# EAGLE design geiger-counter-usb (EAGLE 5.11)
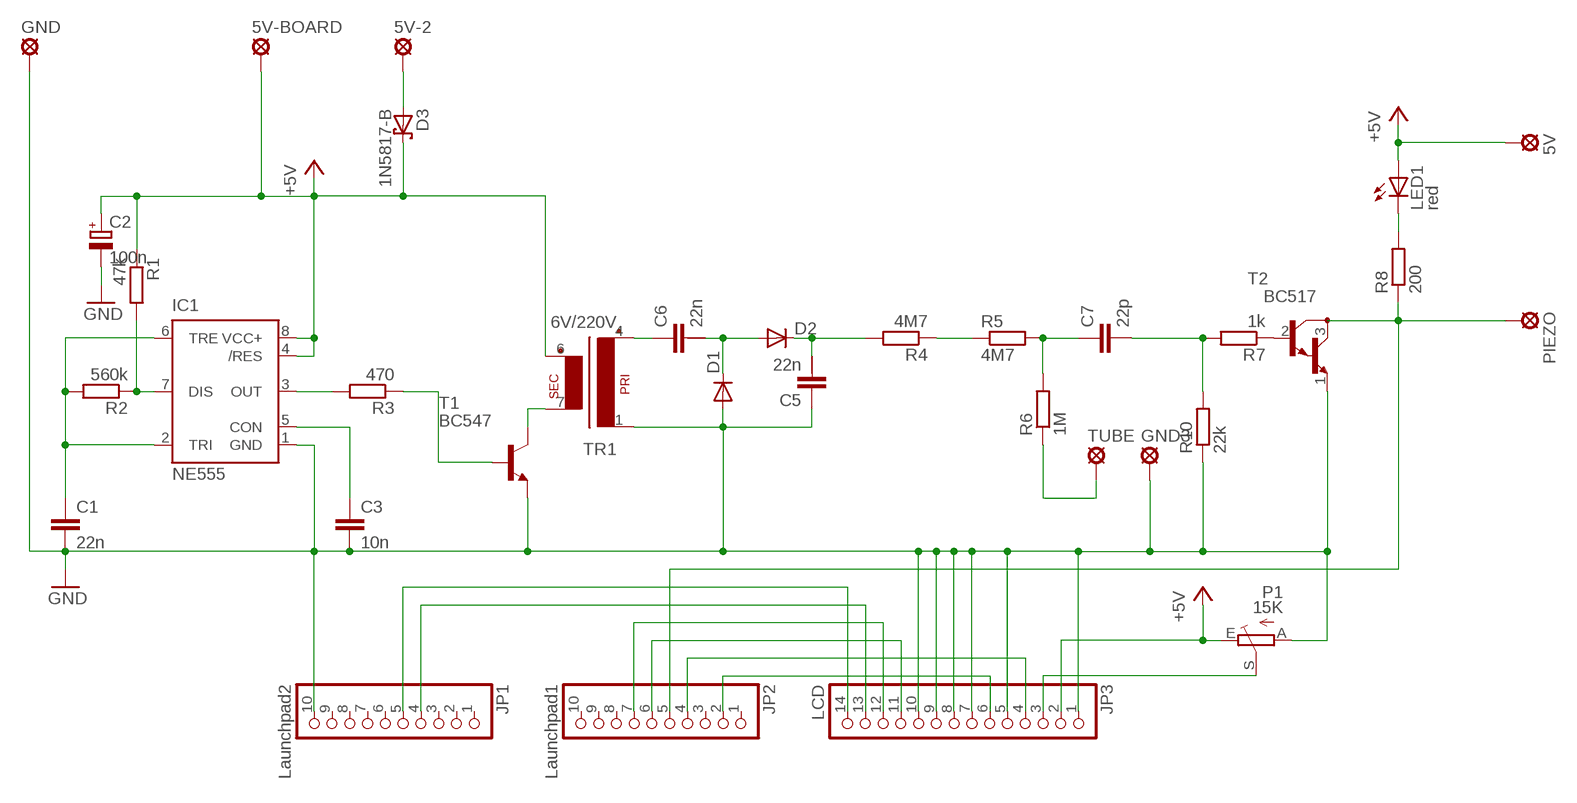
[diagram p0: schematic, sheet 1]

## Parts
5V  MCS08  [MCS08]
5V-2  MCS08  [MCS08]
5V-BOARD  MCS08  [MCS08]
C1  22n  C5/3.5  [C5B3.5]
C2  100n  CPOL-EUB45181B  [B45181B]
C3  10n  C5/3.5  [C5B3.5]
C5  22n  C-10-15/6  [C10-15B6]
C6  22n  C-10-15/6  [C10-15B6]
C7  22p  C15/5  [C15B5]
D1  1N4004  [DO41-10]
D2  1N4004  [DO41-10]
D3  1N5817-B  SCHOTTKY-DIODEDO35-7  [DO35-7]
GND  MCS08  [MCS08]
GND3  MCS08  [MCS08]
IC1  NE555  [DIL-08]
JP1  Launchpad2  PINHD-1X10  [1X10]
JP2  Launchpad1  PINHD-1X10  [1X10]
JP3  LCD  PINHD-1X14  [1X14]
LED1  red  LED3MM  [LED3MM]
P1  15K  TRIM_EU-PT10S  [PT-10S]
PIEZO  MCS08  [MCS08]
R1  47k  R-EU_0207/2V  [0207/2V]
R2  560k  R-EU_0207/2V  [0207/2V]
R3  470  R-EU_0207/2V  [0207/2V]
R4  4M7  R-EU_0207/2V  [0207/2V]
R5  4M7  R-EU_0207/7  [0207/7]
R6  1M  R-EU_0207/2V  [0207/2V]
R7  1k  R-EU_0204/2V  [0204V]
R8  200  R-EU_0207/2V  [0207/2V]
R10  22k  R-EU_0207/2V  [0207/2V]
T1  BC547  [TO92]
T2  BC517  [TO92]
TR1  6V/220V  EE20-1  [EE20-1]
TUBE  MCS08  [MCS08]

## Nets
+5V: 5V-BOARD.MP 5V.MP C2.+ D3.C IC1.4(/RES) IC1.8(VCC+) JP3.2 LED1.A P1.E R1.1 TR1.6(S3)
GND: C1.2 C2.- C3.2 C5.1 D1.A GND3.MP GND.MP IC1.1(GND) JP1.10 JP3.1 JP3.5 JP3.7 JP3.8 JP3.9 JP3.10 P1.A R10.1 T1.1(E) T2.1(E) TR1.1
N$1: R3.1 T1.2(B)
N$2: C1.1 IC1.2(TRI) IC1.6(TRE) R2.2
N$3: IC1.7(DIS) R1.2 R2.1
N$4: LED1.K(C) R8.2
N$5: C3.1 IC1.5(CON)
N$6: R4.1 R5.1
N$7: C7.1 R5.2 R6.2
N$8: C6.1 TR1.4(P2)
N$9: C5.2 D2.C R4.2
N$10: C6.2 D1.C D2.A
N$11: C7.2 R7.2 R10.2
N$12: R6.1 TUBE.MP
N$13: IC1.3(OUT) R3.2
N$14: R7.1 T2.2(B)
N$15: T1.3(C) TR1.7(S4)
N$16: 5V-2.MP D3.A
N$18: JP2.5 PIEZO.MP R8.1 T2.3(C)
N$20: JP1.4 JP3.13
N$22: JP3.3 P1.S
N$23: JP2.2 JP3.6
N$24: JP2.4 JP3.4
N$25: JP2.6 JP3.11
N$26: JP2.7 JP3.12
N$27: JP1.5 JP3.14
Unconnected: C5.3 C6.3 JP1.1 JP1.2 JP1.3 JP1.6 JP1.7 JP1.8 JP1.9 JP2.1 JP2.3 JP2.8 JP2.9 JP2.10

## Library data of the parts
5V 5V-2 5V-BOARD GND GND3 PIEZO TUBE = solpad:MCS08: SOLDER PAD MC S0,8, drill 1.2 mm, distributor Buerklin, 08F130
C1 C3 C7 = capacitor-wima:C: CAPACITOR naming: grid - package width
C2 = rcl:CPOL-EU: POLARIZED CAPACITOR, European symbol
C5 C6 = capacitor-wima:C-: CAPACITOR for alternative placement naming: default grid - extended grid/package width
D1 D2 = diode:1N4004: DIODE general purpose rectifier, 1 A
D3 = diode:SCHOTTKY-DIODE: Schottky Diode
IC1 = st-microelectronics:NE555: General purpose bipolar Timer; MF: Arrow Electronics; MPN: NE555N; OC_FARNELL: 1467742; OC_NEWARK: 89K1486
JP1 JP2 = pinhead:PINHD-1X10: PIN HEADER
JP3 = pinhead:PINHD-1X14: PIN HEADER
LED1 = led:LED: LED OSRAM: - CHIPLED LG R971, LG N971, LY N971, LG Q971, LY Q971, LO R971, LY R971 LH N974, LH R974 LS Q976, LO Q976, LY Q976 LO Q996 - Hyper CHIPLED LW Q18S LB Q993, LB Q99A, LB R99A - SideLED LS A670, LO A670, LY A670, LG A670, LP A670 LB A673, LV A673, LT A673, LW A673 LH A674 LY A675 LS A676, LA A676, LO A676, LY A676, LW A676 LS A679, LY A679, LG A679 - Hyper Micro SIDELED® LS Y876, LA Y876, LO Y876, LY Y876 LT Y87S - SmartLED LW L88C, LW L88S LB L89C, LB L89S, LG L890 LS L89K, LO L89K, LY L89K LS L896, LA L896, LO L896, LY L896 - TOPLED LS T670, LO T670, LY T670, LG T670, LP T670 LSG T670, LSP T670, LSY T670, LOP T670, LYG T670 LG T671, LOG T671, LSG T671 LB T673, LV T673, LT T673, LW T673 LH T674 LS T676, LA T676, LO T676, LY T676, LB T676, LH T676, LSB T676, LW T676 LB T67C, LV T67C, LT T67C, LS T67K, LO T67K, LY T67K, LW E67C LS E67B, LA E67B, LO E67B, LY E67B, LB E67C, LV E67C, LT E67C LW T67C LS T679, LY T679, LG T679 LS T770, LO T770, LY T770, LG T770, LP T770 LB T773, LV T773, LT T773, LW T773 LH T774 LS E675, LA E675, LY E675, LS T675 LS T776, LA T776, LO T776, LY T776, LB T776 LHGB T686 LT T68C, LB T68C - Hyper Mini TOPLED® LB M676 - Mini TOPLED Santana® LG M470 LS M47K, LO M47K, LY M47K Source: http://www.osram.convergy.de LUXEON: - LUMILED® LXK2-PW12-R00, LXK2-PW12-S00, LXK2-PW14-U00, LXK2-PW14-V00 LXK2-PM12-R00, LXK2-PM12-S00, LXK2-PM14-U00 LXK2-PE12-Q00, LXK2-PE12-R00, LXK2-PE12-S00, LXK2-PE14-T00, LXK2-PE14-U00 LXK2-PB12-K00, LXK2-PB12-L00, LXK2-PB12-M00, LXK2-PB14-N00, LXK2-PB14-P00, LXK2-PB14-Q00 LXK2-PR12-L00, LXK2-PR12-M00, LXK2-PR14-Q00, LXK2-PR14-R00 LXK2-PD12-Q00, LXK2-PD12-R00, LXK2-PD12-S00 LXK2-PH12-R00, LXK2-PH12-S00 LXK2-PL12-P00, LXK2-PL12-Q00, LXK2-PL12-R00 Source: www.luxeon.com KINGBRIGHT: KA-3528ASYC Source: www.kingbright.com
P1 = pot:TRIM_EU-: POTENTIOMETER
R1-R8 R10 = rcl:R-EU_: RESISTOR, European symbol
T1 = transistor-neu-to92:BC547: NPN TRANSISTOR
T2 = transistor-npn:BC517*: NPN Darlington Transistor
TR1 = trafo:EE20-1: TRANSFORMER 1 primary winding, 1 secondary winding ERA

## Board
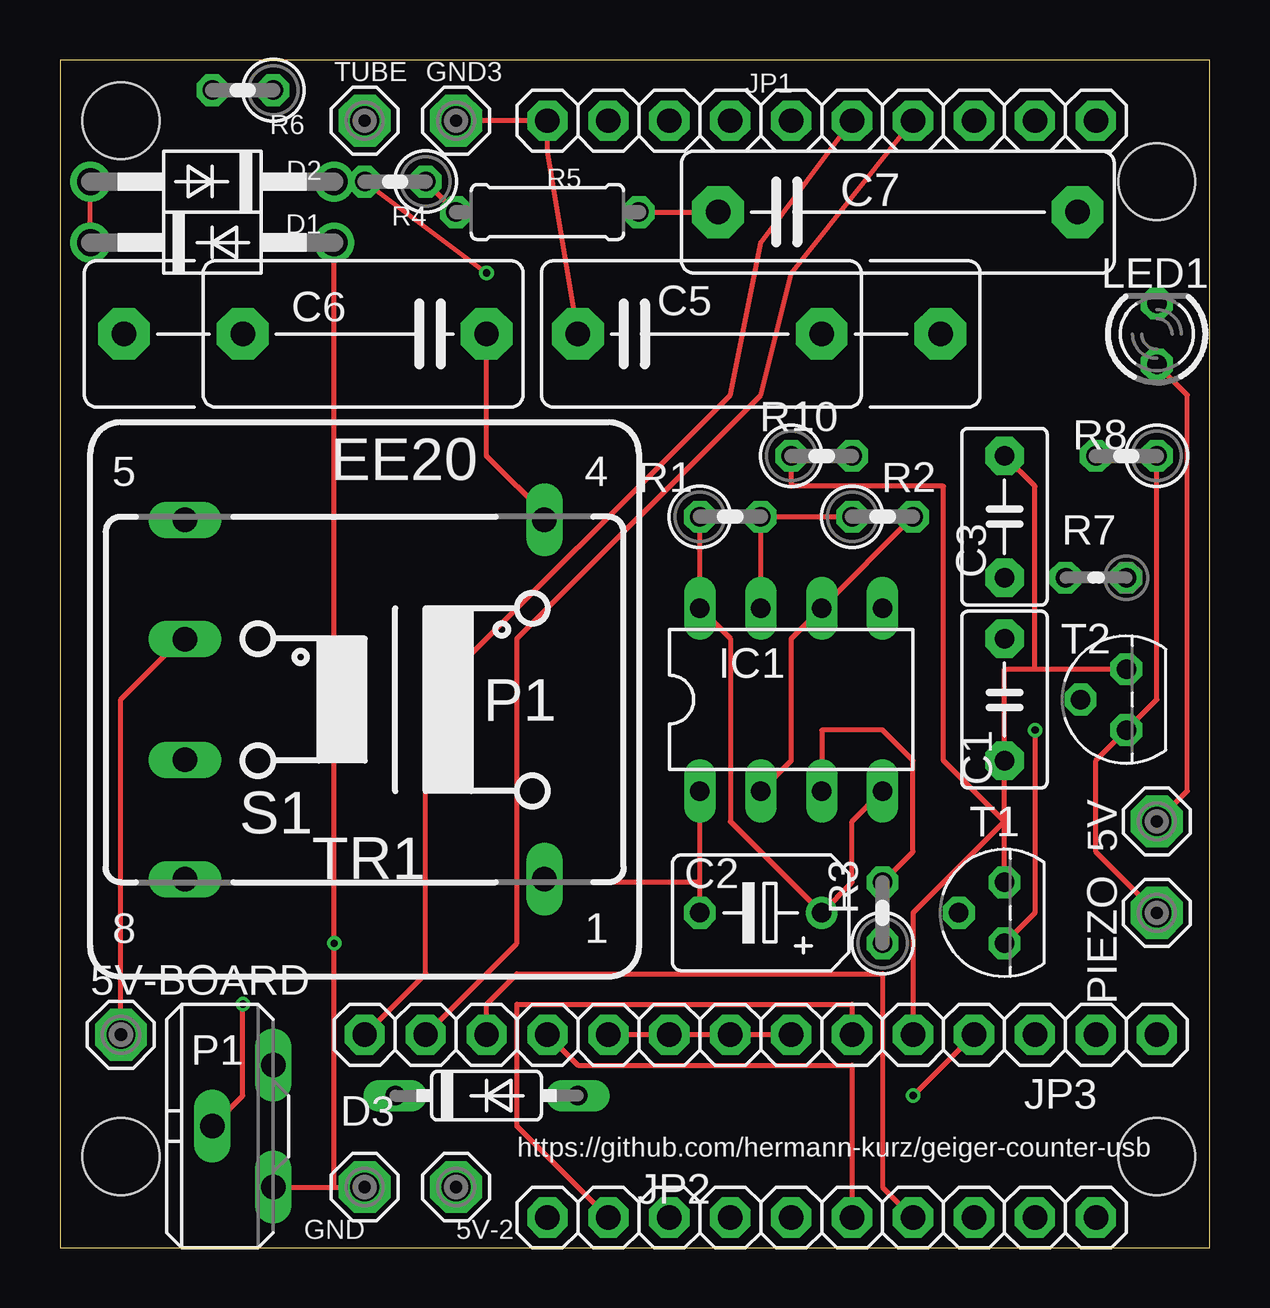
[diagram p1: board, top side]
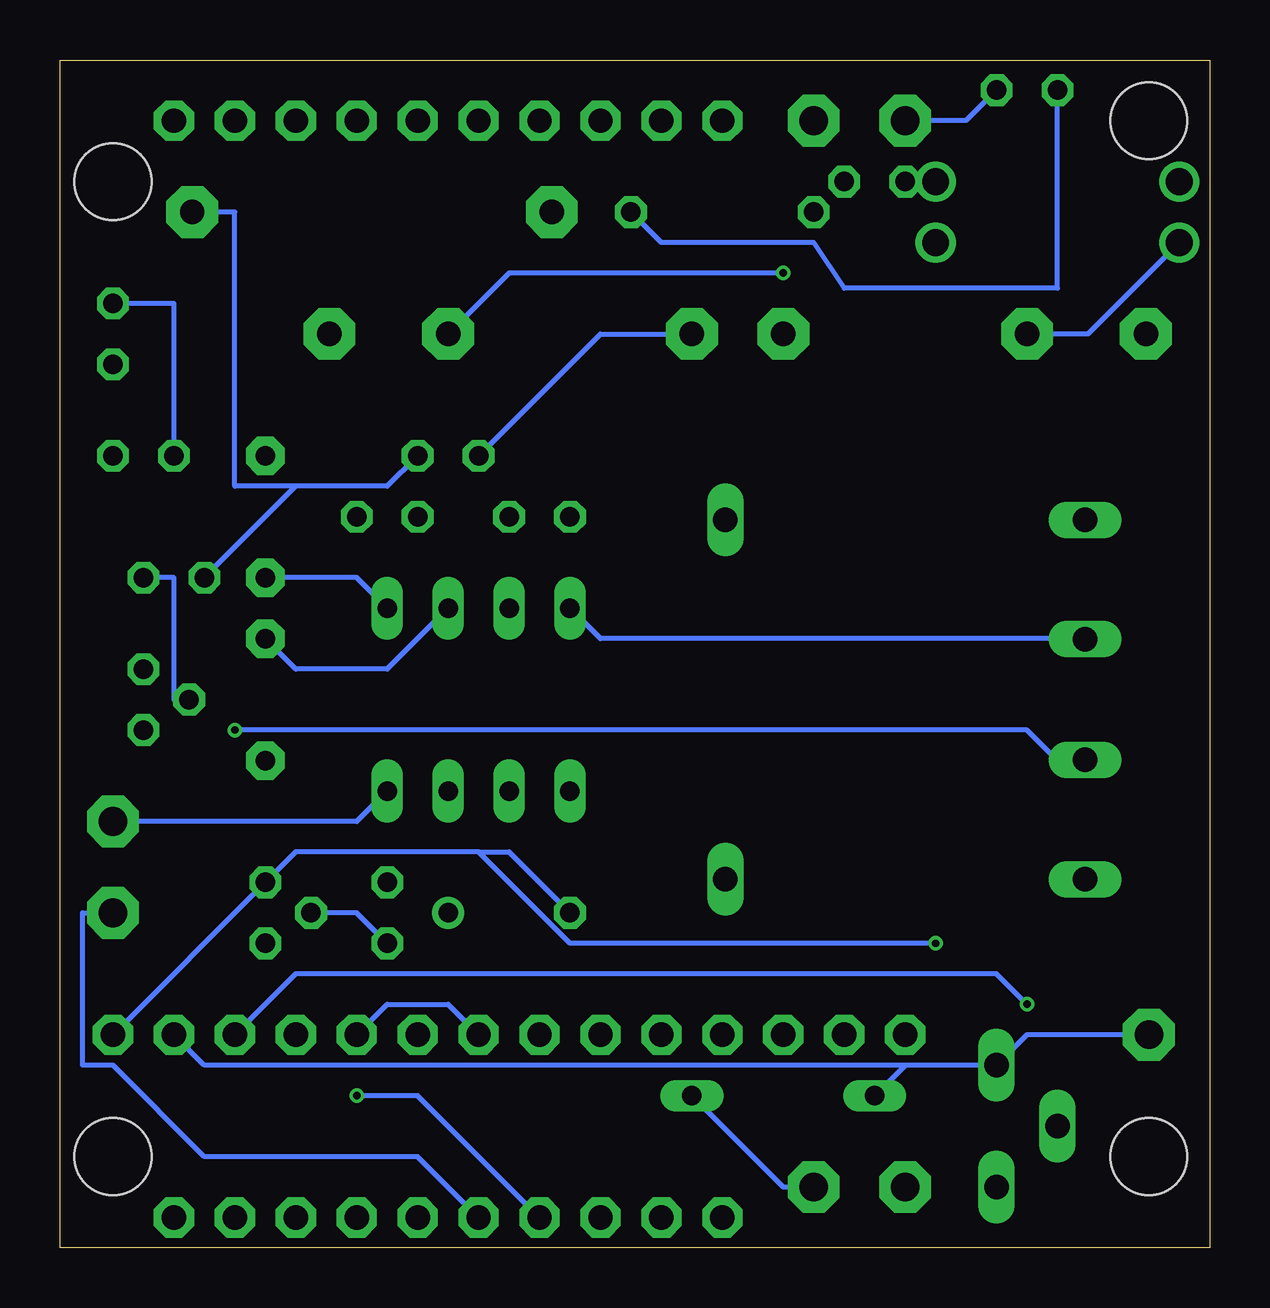
[diagram p2: board, bottom side, seen from below]

Size 47.93 x 49.52 mm. Coordinates in mm from the lower left corner, seen from the top.
Outline: 0,0 47.93,0 47.93,49.52 0,49.52 0,0
Copper layers (1*16): Top 0.035mm / dielectric 1.5mm / Bottom 0.035mm
Design rules "ITead_rule *": minimum track width 8mil, minimum drill 12mil, track to track 10mil, track to pad 10mil, pad to pad 10mil, via to via 10mil, smd to smd 0mil, copper to edge 10mil, drill to drill 10mil, minimum pad ring 10mil, minimum via ring 6mil, stop-mask expansion 2mil, vias tented up to drill 100mil, thermal gap 10mil
Holes 3.2 mm at 2.54,3.81 45.72,3.81 45.72,44.45 2.54,46.99

### Footprints (pad centres in the part's own frame; a part is rotated, then mirrored left to right if it is on the bottom)
MCS08 = drill 1.194 pad 2.159 octagon: MP 0,0
C5B3.5 = drill 0.813 pad 1.6 octagon: 1 -2.54,0; 2 2.54,0
B45181B = drill 0.813 round: + -2.54,0 | drill 0.813 octagon: - 2.54,0
C10-15B6 = drill 1.016 pad 2.159 octagon: 1 -5.08,0; 2 5.08,0; 3 10.033,0
C15B5 = drill 1.016 pad 2.159 octagon: 1 -7.493,0; 2 7.493,0
DO41-10 = drill 1.118 round: A 5.08,0; C -5.08,0
DO35-7 = drill 0.813 long: A 3.81,0; C -3.81,0
DIL-08 = drill 0.813 long: 1 -3.81,-3.81; 2 -1.27,-3.81; 3 1.27,-3.81; 4 3.81,-3.81; 5 3.81,3.81; 6 1.27,3.81; 7 -1.27,3.81; 8 -3.81,3.81
1X10 = drill 1.016 pad 1.676 octagon: 1 -11.43,0; 2 -8.89,0; 3 -6.35,0; 4 -3.81,0; 5 -1.27,0; 6 1.27,0; 7 3.81,0; 8 6.35,0; 9 8.89,0; 10 11.43,0
1X14 = drill 1.016 pad 1.676 octagon: 1 -16.51,0; 2 -13.97,0; 3 -11.43,0; 4 -8.89,0; 5 -6.35,0; 6 -3.81,0; 7 -1.27,0; 8 1.27,0; 9 3.81,0; 10 6.35,0; 11 8.89,0; 12 11.43,0; 13 13.97,0; 14 16.51,0
LED3MM = drill 0.813 octagon: A -1.27,0; K 1.27,0
PT-10S = drill 1.016 long: A -2.54,-1.27; E 2.54,-1.27; S 0,1.27
0207/2V = drill 0.813 octagon: 1 -1.27,0; 2 1.27,0
0207/7 = drill 0.813 octagon: 1 -3.81,0; 2 3.81,0
0204V = drill 0.813 octagon: 1 -1.27,0; 2 1.27,0
TO92 = drill 0.813 octagon: 1 1.27,0; 2 0,1.905; 3 -1.27,0
EE20-1 = drill 1.016 long: 1 -7.493,7.493; 4 -7.493,-7.493; 5 7.493,-7.493; 6 7.493,-2.515; 7 7.493,2.515; 8 7.493,7.493

### Placement (x,y rotation side)
5V  45.72,17.78 90 top
5V-2  16.51,2.54 0 top
5V-BOARD  2.54,8.89 0 top
C1  39.37,22.86 270 top
C2  29.21,13.97 180 top
C3  39.37,30.48 90 top
C5  26.67,38.1 0 top
C6  12.7,38.1 180 top
C7  34.92,43.18 0 top
D1  6.35,41.91 0 top
D2  6.35,44.45 180 top
D3  17.78,6.35 0 top
GND  12.7,2.54 0 top
GND3  16.51,46.99 0 top
IC1  30.48,22.86 0 top
JP1  31.75,46.99 180 top
JP2  31.75,1.27 0 top
JP3  29.21,8.89 180 top
LED1  45.72,38.1 90 top
P1  7.62,5.08 90 top
PIEZO  45.72,13.97 90 top
R1  27.94,30.48 0 top
R2  34.29,30.48 0 top
R3  34.29,13.97 90 top
R4  13.97,44.45 180 top
R5  20.32,43.18 0 top
R6  7.62,48.26 180 top
R7  43.18,27.94 180 top
R8  44.45,33.02 180 top
R10  31.75,33.02 0 top
T1  39.37,13.97 90 top
T2  44.45,22.86 90 top
TR1  12.7,22.86 180 top
TUBE  12.7,46.99 0 top

### Tracks (layer width: path | path; a pad name or v marks a point on that pad's centre or on a via)
+5V
  Top 0.203: IC1.4 33.02,17.78 33.02,15.24 C2.+ 27.94,17.78 27.94,25.4 IC1.8 R1.1 | LED1.A 46.99,35.56 46.99,19.05 5V.MP | 5V-BOARD.MP 2.54,22.86 5.08,25.4 TR1.6
  Bottom 0.203: 12.7,7.62 D3.C | 12.7,7.62 P1.E 7.62,8.89 5V-BOARD.MP | JP3.2 41.91,7.62 12.7,7.62 | IC1.4 35.56,17.78 5V.MP | IC1.8 25.4,25.4 6.35,25.4 TR1.6
GND  (via drill 0.3)
  Top 0.203: JP3.10 JP3.9 JP3.8 JP3.7 | 26.67,15.24 IC1.1 | C2.- 26.67,15.24 | 26.67,15.24 20.32,15.24 TR1.1 | 39.37,17.78 C1.2 39.37,24.13 40.64,24.13 | T1.1 39.37,17.78 | 40.64,24.13 T2.1 | C3.2 40.64,31.75 40.64,24.13 | JP3.5 35.56,13.97 39.37,17.78 | 11.43,2.54 GND.MP | P1.A 11.43,2.54 | GND3.MP JP1.10 20.32,45.72 C5.1 | 11.43,2.54 v11.43,12.7 D1.A | 39.37,17.78 36.83,20.32 36.83,31.75 30.48,31.75 R10.1
  Bottom 0.203: JP3.5 34.29,10.16 31.75,10.16 JP3.7 | JP3.1 T1.1 38.1,16.51 30.48,16.51 | C2.- 29.21,16.51 30.48,16.51 | R10.1 25.4,38.1 C5.1 | 30.48,16.51 26.67,12.7 v11.43,12.7
N$1
  Bottom 0.203: R3.1 35.56,13.97 T1.2
N$2
  Top 0.203: IC1.2 30.48,20.32 30.48,25.4 IC1.6 R2.2
  Bottom 0.203: C1.1 38.1,24.13 34.29,24.13 IC1.6
N$3
  Top 0.203: IC1.7 R1.2 R2.1
N$4
  Bottom 0.203: R8.2 43.18,39.37 LED1.K
N$5
  Bottom 0.203: IC1.5 35.56,27.94 C3.1
N$6
  Top 0.203: R5.1 R4.1
N$7
  Top 0.203: R5.2 C7.1
  Bottom 0.203: R6.2 6.35,40.01 15.24,40.01 16.51,41.91 22.86,41.91 R5.2
N$8
  Top 0.203: C6.1 17.78,33.02 20.32,30.48 TR1.4
N$9  (via drill 0.3)
  Top 0.203: R4.2 v17.78,40.64
  Bottom 0.203: D2.C R4.2 | v17.78,40.64 29.21,40.64 C5.2
N$10
  Top 0.203: D1.C D2.A
  Bottom 0.203: D1.C 5.08,38.1 C6.2
N$11
  Bottom 0.203: R10.2 34.29,31.75 38.1,31.75 | 38.1,31.75 R7.2 | 38.1,31.75 40.64,31.75 40.64,43.18 C7.2
N$12
  Bottom 0.203: R6.1 10.16,46.99 TUBE.MP
N$13
  Top 0.203: R3.2 35.56,16.51 35.56,20.32 34.29,21.59 31.75,21.59 IC1.3
N$14
  Bottom 0.203: R7.1 43.18,27.94 43.18,22.86 T2.2
N$15  (via drill 0.3)
  Top 0.203: T1.3 40.64,13.97 v40.64,21.59
  Bottom 0.203: v40.64,21.59 7.62,21.59 6.35,20.32 TR1.7
N$16
  Bottom 0.203: D3.A 17.78,2.54 5V-2.MP
N$18
  Top 0.203: R8.1 45.72,22.86 T2.3 43.18,20.32 43.18,16.51 PIEZO.MP
  Bottom 0.203: JP2.5 33.02,3.81 41.91,3.81 45.72,7.62 46.99,7.62 46.99,13.97 PIEZO.MP
N$20
  Top 0.203: JP3.13 19.05,12.7 19.05,25.4 29.21,35.56 30.48,40.64 JP1.4
N$22  (via drill 0.3)
  Top 0.203: P1.S 7.62,6.35 v7.62,10.16
  Bottom 0.203: v7.62,10.16 8.89,11.43 38.1,11.43 JP3.3
N$23
  Top 0.203: JP2.2 19.05,5.08 19.05,10.16 33.02,10.16 JP3.6
N$24  (via drill 0.3)
  Top 0.203: v35.56,6.35 JP3.4
  Bottom 0.203: JP2.4 33.02,6.35 v35.56,6.35
N$25
  Top 0.203: JP3.11 21.59,7.62 33.02,7.62 JP2.6
N$26
  Top 0.203: JP3.12 17.78,10.16 19.05,11.43 34.29,11.43 34.29,2.54 JP2.7
N$27
  Top 0.203: JP3.14 15.24,11.43 15.24,22.86 27.94,35.56 29.21,41.91 JP1.5

### Text on the board
tNames: https://github.com/hermann-kurz/geiger-counter-usb